# Altium schematic sheet Sheet3.SchDoc: Memory ICs
size B; DocumentNumber: 3; SheetNumber: 3; SheetTotal: 5
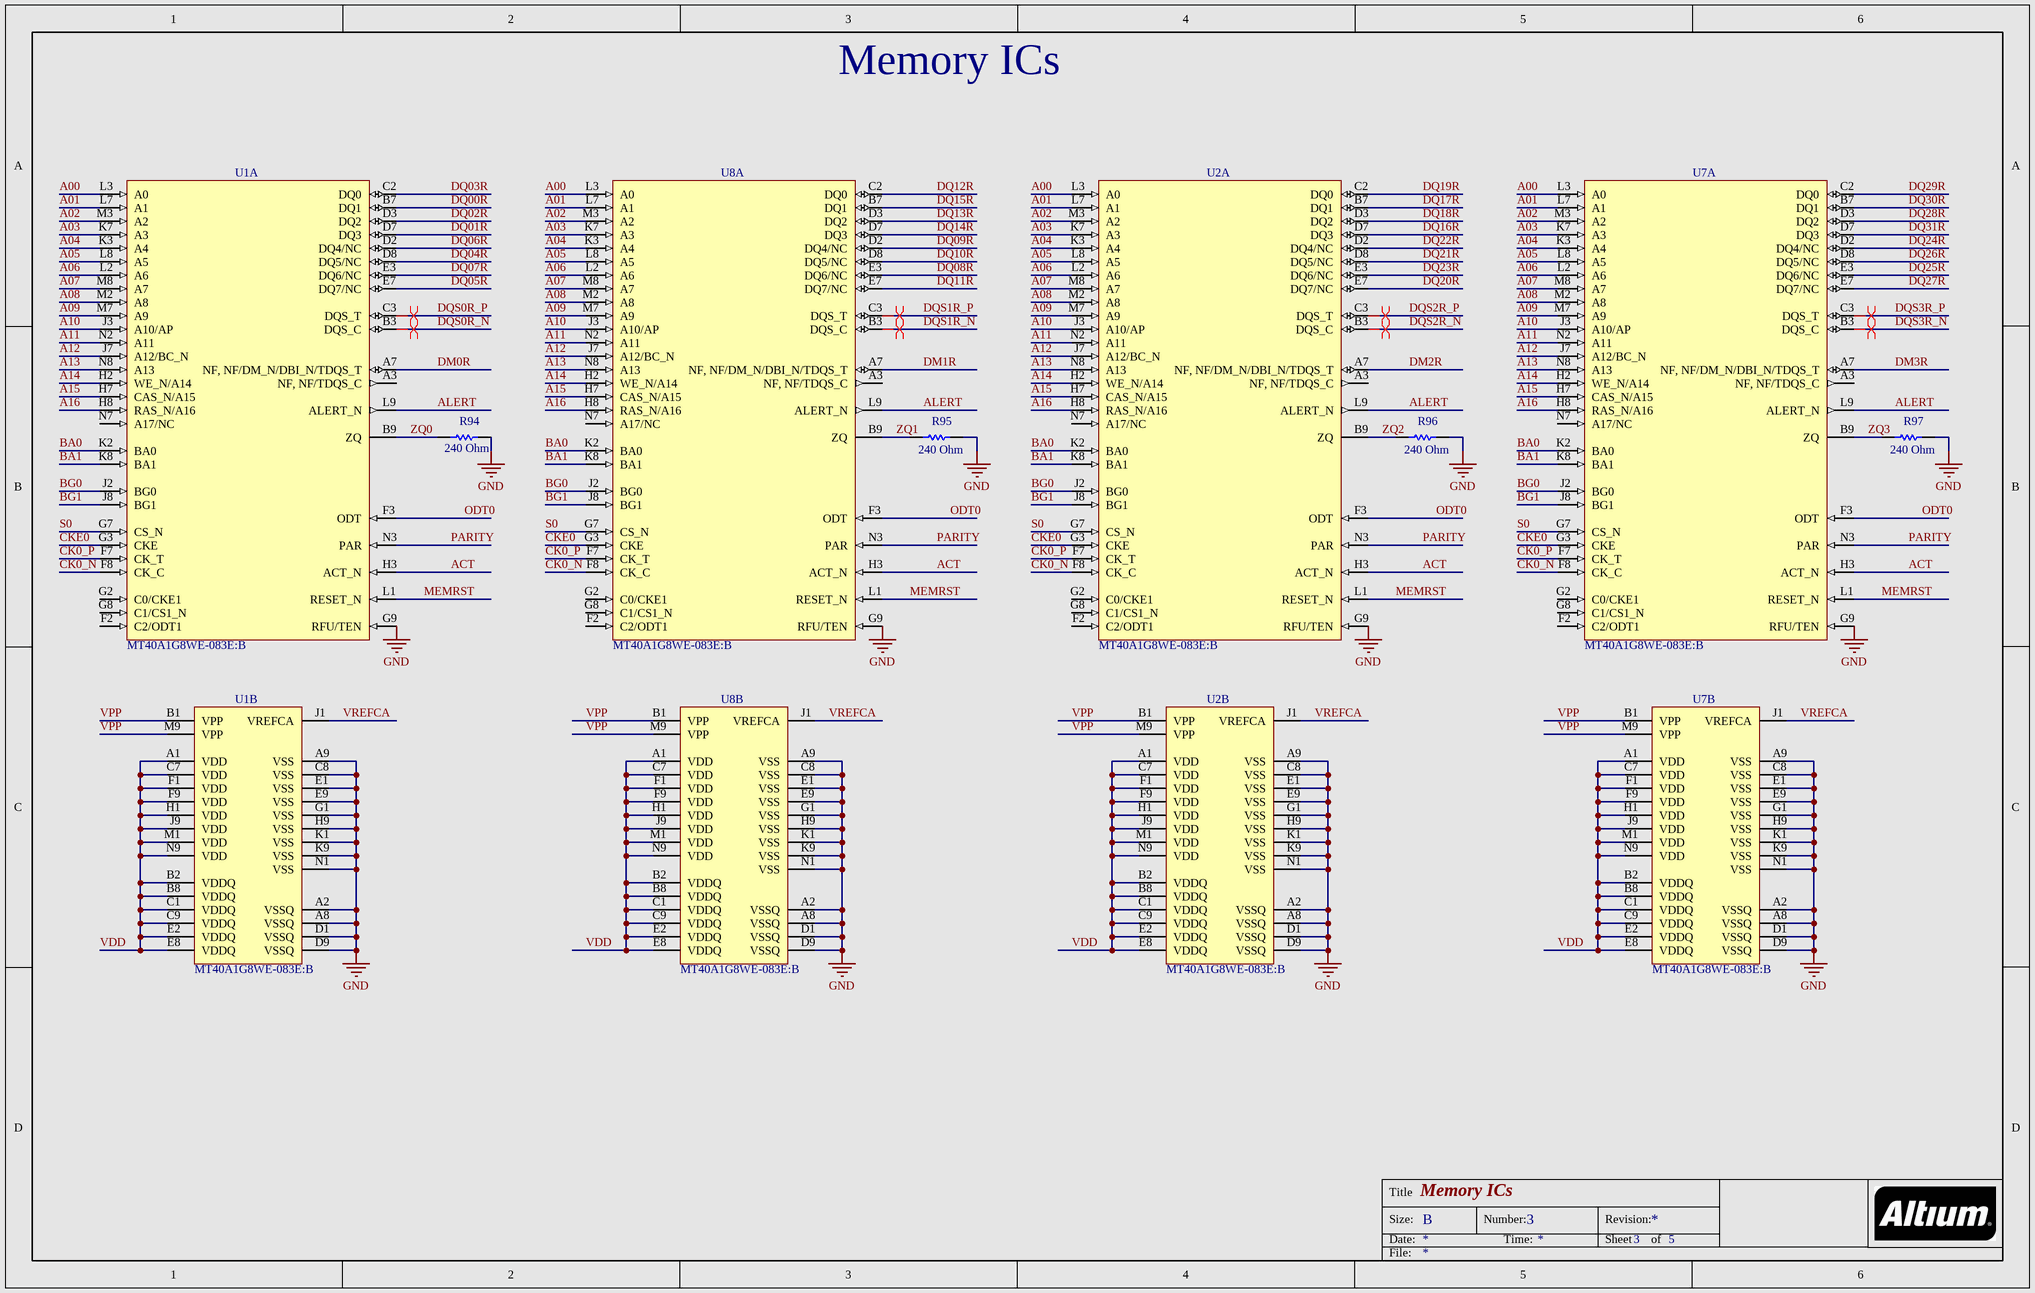
[diagram p0: Sheet3.SchDoc]

## Parts
R94  Resistance: 240 Ohm  [RESC1005X40X25ML05T05]  (hidden comment: ERJ-2GEJ241x)
R95  Resistance: 240 Ohm  [RESC1005X40X25ML05T05]  (hidden comment: ERJ-2GEJ241x)
R96  Resistance: 240 Ohm  [RESC1005X40X25ML05T05]  (hidden comment: ERJ-2GEJ241x)
R97  Resistance: 240 Ohm  [RESC1005X40X25ML05T05]  (hidden comment: ERJ-2GEJ241x)
U1  MT40A1G8WE-083E:B  [MICT-WE-78]  (parts A,B of 2)
U2  MT40A1G8WE-083E:B  [MICT-WE-78]  (parts A,B of 2)
U7  MT40A1G8WE-083E:B  [MICT-WE-78]  (parts A,B of 2)
U8  MT40A1G8WE-083E:B  [MICT-WE-78]  (parts A,B of 2)

## Nets
GND: R94.1 R95.1 R96.1 R97.1 U1.A2(VSSQ) U1.A8(VSSQ) U1.A9(VSS) U1.C8(VSS) U1.D1(VSSQ) U1.D9(VSSQ) U1.E1(VSS) U1.E9(VSS) U1.G1(VSS) U1.G9(RFU/TEN) U1.H9(VSS) U1.K1(VSS) U1.K9(VSS) U1.N1(VSS) U2.A2(VSSQ) U2.A8(VSSQ) U2.A9(VSS) U2.C8(VSS) U2.D1(VSSQ) U2.D9(VSSQ) U2.E1(VSS) U2.E9(VSS) U2.G1(VSS) U2.G9(RFU/TEN) U2.H9(VSS) U2.K1(VSS) U2.K9(VSS) U2.N1(VSS) U7.A2(VSSQ) U7.A8(VSSQ) U7.A9(VSS) U7.C8(VSS) U7.D1(VSSQ) U7.D9(VSSQ) U7.E1(VSS) U7.E9(VSS) U7.G1(VSS) U7.G9(RFU/TEN) U7.H9(VSS) U7.K1(VSS) U7.K9(VSS) U7.N1(VSS) U8.A2(VSSQ) U8.A8(VSSQ) U8.A9(VSS) U8.C8(VSS) U8.D1(VSSQ) U8.D9(VSSQ) U8.E1(VSS) U8.E9(VSS) U8.G1(VSS) U8.G9(RFU/TEN) U8.H9(VSS) U8.K1(VSS) U8.K9(VSS) U8.N1(VSS)
A00: U1.L3(A0) U2.L3(A0) U7.L3(A0) U8.L3(A0)
A01: U1.L7(A1) U2.L7(A1) U7.L7(A1) U8.L7(A1)
A02: U1.M3(A2) U2.M3(A2) U7.M3(A2) U8.M3(A2)
A03: U1.K7(A3) U2.K7(A3) U7.K7(A3) U8.K7(A3)
A04: U1.K3(A4) U2.K3(A4) U7.K3(A4) U8.K3(A4)
A05: U1.L8(A5) U2.L8(A5) U7.L8(A5) U8.L8(A5)
A06: U1.L2(A6) U2.L2(A6) U7.L2(A6) U8.L2(A6)
A07: U1.M8(A7) U2.M8(A7) U7.M8(A7) U8.M8(A7)
A08: U1.M2(A8) U2.M2(A8) U7.M2(A8) U8.M2(A8)
A09: U1.M7(A9) U2.M7(A9) U7.M7(A9) U8.M7(A9)
A10: U1.J3(A10/AP) U2.J3(A10/AP) U7.J3(A10/AP) U8.J3(A10/AP)
A11: U1.N2(A11) U2.N2(A11) U7.N2(A11) U8.N2(A11)
A12: U1.J7(A12/BC_N) U2.J7(A12/BC_N) U7.J7(A12/BC_N) U8.J7(A12/BC_N)
A13: U1.N8(A13) U2.N8(A13) U7.N8(A13) U8.N8(A13)
A14: U1.H2(WE_N/A14) U2.H2(WE_N/A14) U7.H2(WE_N/A14) U8.H2(WE_N/A14)
A15: U1.H7(CAS_N/A15) U2.H7(CAS_N/A15) U7.H7(CAS_N/A15) U8.H7(CAS_N/A15)
A16: U1.H8(RAS_N/A16) U2.H8(RAS_N/A16) U7.H8(RAS_N/A16) U8.H8(RAS_N/A16)
ACT: U1.H3(ACT_N) U2.H3(ACT_N) U7.H3(ACT_N) U8.H3(ACT_N)
ALERT: U1.L9(ALERT_N) U2.L9(ALERT_N) U7.L9(ALERT_N) U8.L9(ALERT_N)
BA0: U1.K2(BA0) U2.K2(BA0) U7.K2(BA0) U8.K2(BA0)
BA1: U1.K8(BA1) U2.K8(BA1) U7.K8(BA1) U8.K8(BA1)
BG0: U1.J2(BG0) U2.J2(BG0) U7.J2(BG0) U8.J2(BG0)
BG1: U1.J8(BG1) U2.J8(BG1) U7.J8(BG1) U8.J8(BG1)
CK0_N: U1.F8(CK_C) U2.F8(CK_C) U7.F8(CK_C) U8.F8(CK_C)
CK0_P: U1.F7(CK_T) U2.F7(CK_T) U7.F7(CK_T) U8.F7(CK_T)
CKE0: U1.G3(CKE) U2.G3(CKE) U7.G3(CKE) U8.G3(CKE)
DM0R: U1.A7(NF,_NF/DM_N/DBI_N/TDQS_T)
DM1R: U8.A7(NF,_NF/DM_N/DBI_N/TDQS_T)
DM2R: U2.A7(NF,_NF/DM_N/DBI_N/TDQS_T)
DM3R: U7.A7(NF,_NF/DM_N/DBI_N/TDQS_T)
DQ00R: U1.B7(DQ1)
DQ01R: U1.D7(DQ3)
DQ02R: U1.D3(DQ2)
DQ03R: U1.C2(DQ0)
DQ04R: U1.D8(DQ5/NC)
DQ05R: U1.E7(DQ7/NC)
DQ06R: U1.D2(DQ4/NC)
DQ07R: U1.E3(DQ6/NC)
DQ08R: U8.E3(DQ6/NC)
DQ09R: U8.D2(DQ4/NC)
DQ10R: U8.D8(DQ5/NC)
DQ11R: U8.E7(DQ7/NC)
DQ12R: U8.C2(DQ0)
DQ13R: U8.D3(DQ2)
DQ14R: U8.D7(DQ3)
DQ15R: U8.B7(DQ1)
DQ16R: U2.D7(DQ3)
DQ17R: U2.B7(DQ1)
DQ18R: U2.D3(DQ2)
DQ19R: U2.C2(DQ0)
DQ20R: U2.E7(DQ7/NC)
DQ21R: U2.D8(DQ5/NC)
DQ22R: U2.D2(DQ4/NC)
DQ23R: U2.E3(DQ6/NC)
DQ24R: U7.D2(DQ4/NC)
DQ25R: U7.E3(DQ6/NC)
DQ26R: U7.D8(DQ5/NC)
DQ27R: U7.E7(DQ7/NC)
DQ28R: U7.D3(DQ2)
DQ29R: U7.C2(DQ0)
DQ30R: U7.B7(DQ1)
DQ31R: U7.D7(DQ3)
DQS0R_N: U1.B3(DQS_C)
DQS0R_P: U1.C3(DQS_T)
DQS1R_N: U8.B3(DQS_C)
DQS1R_P: U8.C3(DQS_T)
DQS2R_N: U2.B3(DQS_C)
DQS2R_P: U2.C3(DQS_T)
DQS3R_N: U7.B3(DQS_C)
DQS3R_P: U7.C3(DQS_T)
MEMRST: U1.L1(RESET_N) U2.L1(RESET_N) U7.L1(RESET_N) U8.L1(RESET_N)
ODT0: U1.F3(ODT) U2.F3(ODT) U7.F3(ODT) U8.F3(ODT)
PARITY: U1.N3(PAR) U2.N3(PAR) U7.N3(PAR) U8.N3(PAR)
S0: U1.G7(CS_N) U2.G7(CS_N) U7.G7(CS_N) U8.G7(CS_N)
VDD: U1.A1(VDD) U1.B2(VDDQ) U1.B8(VDDQ) U1.C1(VDDQ) U1.C7(VDD) U1.C9(VDDQ) U1.E2(VDDQ) U1.E8(VDDQ) U1.F1(VDD) U1.F9(VDD) U1.H1(VDD) U1.J9(VDD) U1.M1(VDD) U1.N9(VDD) U2.A1(VDD) U2.B2(VDDQ) U2.B8(VDDQ) U2.C1(VDDQ) U2.C7(VDD) U2.C9(VDDQ) U2.E2(VDDQ) U2.E8(VDDQ) U2.F1(VDD) U2.F9(VDD) U2.H1(VDD) U2.J9(VDD) U2.M1(VDD) U2.N9(VDD) U7.A1(VDD) U7.B2(VDDQ) U7.B8(VDDQ) U7.C1(VDDQ) U7.C7(VDD) U7.C9(VDDQ) U7.E2(VDDQ) U7.E8(VDDQ) U7.F1(VDD) U7.F9(VDD) U7.H1(VDD) U7.J9(VDD) U7.M1(VDD) U7.N9(VDD) U8.A1(VDD) U8.B2(VDDQ) U8.B8(VDDQ) U8.C1(VDDQ) U8.C7(VDD) U8.C9(VDDQ) U8.E2(VDDQ) U8.E8(VDDQ) U8.F1(VDD) U8.F9(VDD) U8.H1(VDD) U8.J9(VDD) U8.M1(VDD) U8.N9(VDD)
VPP: U1.B1(VPP) U1.M9(VPP) U2.B1(VPP) U2.M9(VPP) U7.B1(VPP) U7.M9(VPP) U8.B1(VPP) U8.M9(VPP)
VREFCA: U1.J1(VREFCA) U2.J1(VREFCA) U7.J1(VREFCA) U8.J1(VREFCA)
ZQ0: R94.2 U1.B9(ZQ)
ZQ1: R95.2 U8.B9(ZQ)
ZQ2: R96.2 U2.B9(ZQ)
ZQ3: R97.2 U7.B9(ZQ)

Not connected (* = marked no-connect by the designer): U1 A3(NF,_NF/TDQS_C) F2(C2/ODT1) G2(C0/CKE1) G8(C1/CS1_N) N7(A17/NC); U2 A3(NF,_NF/TDQS_C) F2(C2/ODT1) G2(C0/CKE1) G8(C1/CS1_N) N7(A17/NC); U7 A3(NF,_NF/TDQS_C) F2(C2/ODT1) G2(C0/CKE1) G8(C1/CS1_N) N7(A17/NC); U8 A3(NF,_NF/TDQS_C) F2(C2/ODT1) G2(C0/CKE1) G8(C1/CS1_N) N7(A17/NC)

## Layout directives
differential pair: DQS0R_N, DQS0R_P, DQS1R_N, DQS1R_P, DQS2R_N, DQS2R_P, DQS3R_N, DQS3R_P

## Notes on the sheet
- Title
- Size:
- Date:
- B
- Number:
- Time:
- Revision:
- Sheet
- of
- File:

## Library data of the parts
R94-R97 = CMP-2002-00493-3: Chip Resistor, 240 Ohm, +/- 5%, 100 mW, -55 to 155 degC, 0402 (1005 Metric), RoHS, Tape and Reel; Manufacturer: Basic Passives; Voltage Rating: 50 V; Case\/Package: 0402; Power Rating: 100 mW; PackageReference: 0402; ComponentLink1URL: http://www.panasonic.com/; ComponentLink2Description: Datasheet; PackageDescription: 2-Pin Surface Mount Device, Body 1 x 0.5 mm; Tolerance: 5%; Radiation Hardening: No; Packaging: Tape and Reel; Case Code (Metric): 1005; PartNumber: ERJ-2GEJ241x; Case Code (Imperial): 0402; Mount: Surface Mount; REACH SVHC: Yes; Length: 1 mm; Mounting Technology: Surface Mount; Max Operating Temperature: 155 degC; Height: 0.35 mm; Width: 0.5 mm; Package Quantity: 10000; RoHSCompliant: true; DatasheetVersion: 03/2015; Pins: 2; ComponentLink1Description: Manufacturer URL; Min Operating Temperature: -55 degC; ComponentLink2URL: http://industrial.panasonic.com/cdbs/www-data/pdf/RDA0000/AOA0000C84.pdf
U1 U2 U7 U8 = CMP-1738-00001-1: 8 Gb DDR4 SDRAM, 1 Gig x 8, 1.2 V, 0 to 95 degC, 78-Ball FBGA (WE), RoHS; DatasheetVersion: Rev. E, 05/2016; ComponentLink2Description: Datasheet; ComponentLink2URL: https://www.micron.com/~/media/documents/products/data-sheet/dram/ddr4/8gb_ddr4_sdram.pdf; PartNumber: MT40A1G8WE-083E:B; PackageDescription: 78-Ball Ball Grid Array, Body 8 x 12 mm, Pitch 0.8 mm; ComponentLink1URL: http://www.micron.com/; ComponentLink1Description: Manufacturer URL; Mounting Technology: Surface Mount; PartId: 1